# Altium schematic sheet S6XT10W POWER.SchDoc
size A4
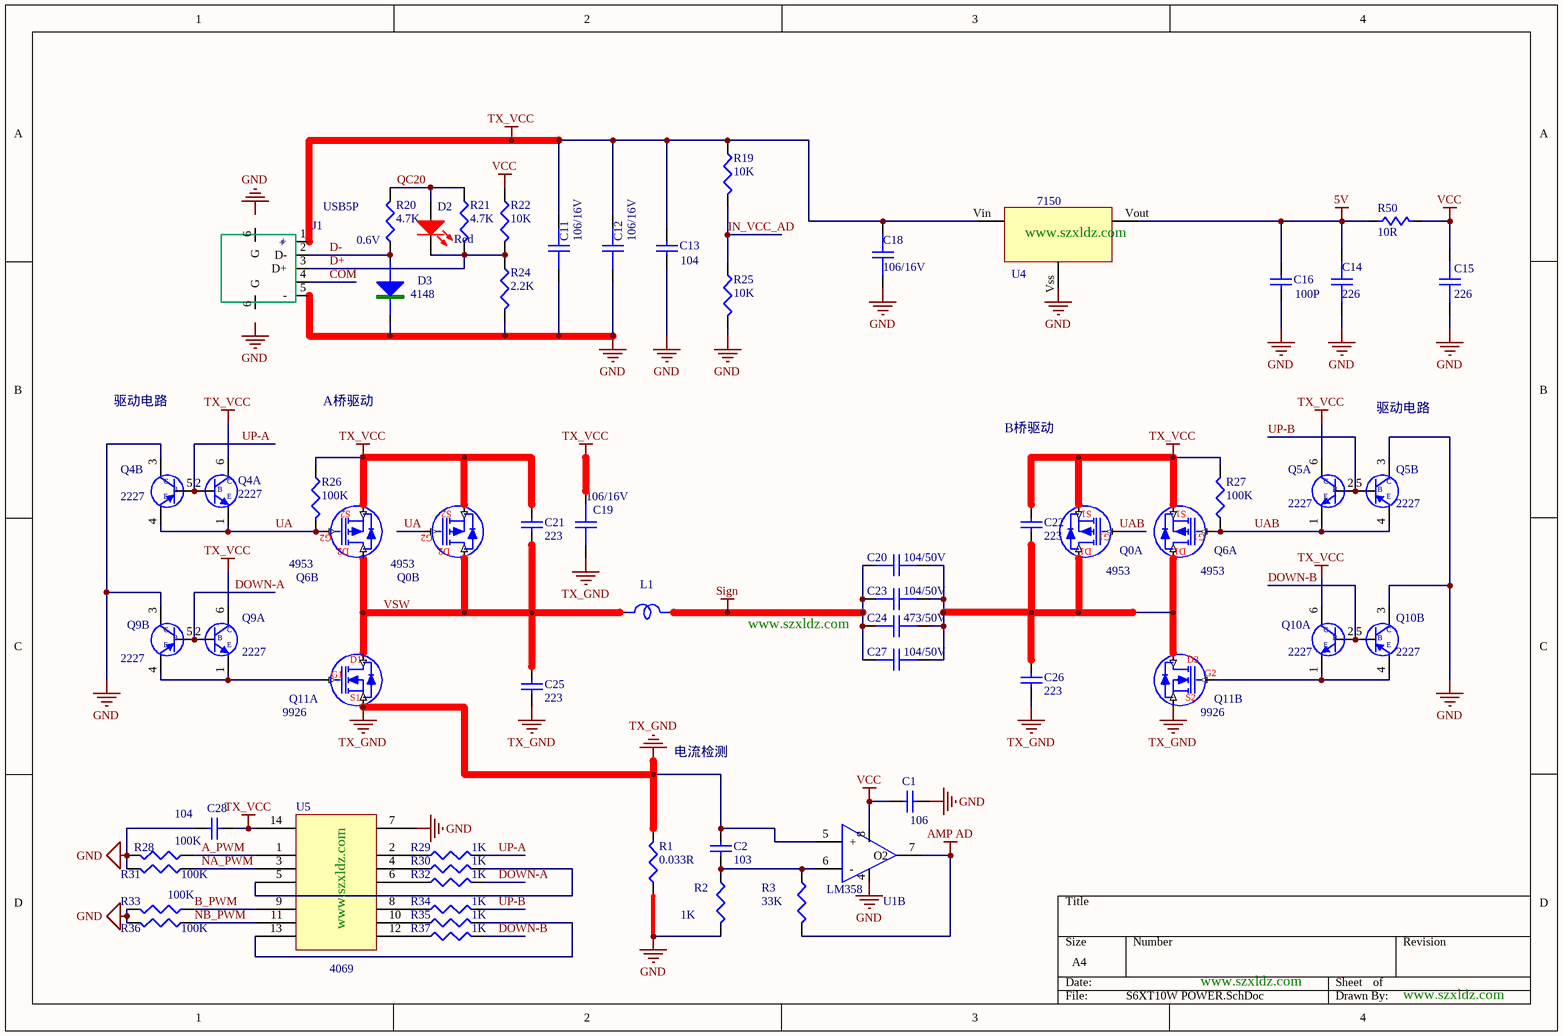
[diagram p0: S6XT10W POWER.SchDoc]

## Parts
C1  106  [C0603]
C2  103  [C0402]
C11  106/16V  [C0805]
C12  106/16V  [C0805]
C13  104  [C0402]
C14  226  [C0805]
C15  226  [C0805]
C16  100P  [C0402]
C18  106/16V  [C0805]
C19  106/16V  [C0805]
C20  104/50V  [C1206]
C21  223  [C0603]
C22  223  [C0603]
C23  104/50V  [C1206]
C24  473/50V  [C1206]
C25  223  [C1206]
C26  223  [C0603]
C27  104/50V  [C1206]
C28  104  [C0402]
D2  Red  [LED0603]
D3  4148  [SOD323]
J1  USB5P  [USB -MRO05]
L1  (no value)  [l5mm]
Q0  4953  [SOP8D]  (parts A,B of 2)
Q4  2227  [SOT363]  (parts A,B of 2)
Q5  2227  [SOT363]  (parts A,B of 2)
Q6  4953  [SOP8D]  (parts A,B of 2)
Q9  2227  [SOT363]  (parts A,B of 2)
Q10  2227  [SOT363]  (parts A,B of 2)
Q11  9926  [SOP8D]  (parts A,B of 2)
R1  0.033R  [R0805]
R2  1K  [R0402]
R3  33K  [R0402]
R19  10K  [R0402]
R20  4.7K  [R0402]
R21  4.7K  [R0402]
R22  10K  [R0402]
R24  2.2K  [R0402]
R25  10K  [R0402]
R26  100K  [R0402]
R27  100K  [R0402]
R28  100K  [R0402]
R29  1K  [R0402]
R30  1K  [R0402]
R31  100K  [R0402]
R32  1K  [R0402]
R33  100K  [R0402]
R34  1K  [R0402]
R35  1K  [R0402]
R36  100K  [R0402]
R37  1K  [R0402]
R50  10R  [R0402]
U1  LM358  [SOP8]  (part B of 2)
U4  7150  [SOT89a]
U5  4069  [SOP14]

## Nets
5V: C14.1 C16.1 R50.1 U4.Vout
AMP AD: R3.2 U1.7(O2)
GND: C1.1 C11.2 C12.2 C13.2 C14.2 C15.1 C16.2 C18.2 C28.1 D3.2 J1.5(-) Q4.3(C) Q5.3(C) Q9.3(C) Q10.3(C) R1.1 R2.2 R24.1 R25.1 R28.2 R31.2 R33.2 R36.2 U1.4 U4.Vss U5.7
Sign: C20.1 C23.1 C24.1 C27.1 L1.2
TX_GND: C2.1 C19.2 C25.1 C26.1 Q11.E1(S1) Q11.E2(S2) R1.2 U1.5(+)
TX_VCC: C11.1 C12.1 C13.1 C18.1 C19.1 C21.2 C22.2 C28.2 J1.1(+) Q0.E1(S1) Q0.E2(S2) Q4.6(C) Q5.6(C) Q6.E1(S1) Q6.E2(S2) Q9.6(C) Q10.6(C) R19.2 R26.1 R27.2 U4.Vin U5.14
VCC: C1.2 C15.2 R22.2 R50.2 U1.8
A_PWM: R28.1 U5.1
B_PWM: R33.1 U5.9
COM: J1.4
D+: D2.2(K) J1.3(D+) R21.1 R22.1 R24.2
D-: D3.1 J1.2(D-) R20.2
DOWN-A: Q9.2(B) Q9.5(B) R32.2
DOWN-B: Q10.2(B) Q10.5(B) R37.2
IN_VCC_AD: R19.1 R25.2
NA_PWM: R31.1 U5.3
NB_PWM: R36.1 U5.11
QC20: D2.1(A) R20.1 R21.2
UA: Q0.B2(G2) Q4.1(E) Q4.4(E) Q6.B2(G2) R26.2
UAB: Q0.B1(G1) Q5.1(E) Q5.4(E) Q6.B1(G1) R27.1
UP-A: Q4.2(B) Q4.5(B) R29.2
UP-B: Q5.2(B) Q5.5(B) R34.2
VSW: C21.1 C25.2 L1.1 Q0.C2(D2) Q6.C2(D2) Q11.C1(D1)
NetC2_2: C2.2 R2.1 R3.1 U1.6(-)
NetC20_2: C20.2 C22.1 C23.2 C24.2 C26.2 C27.2 Q0.C1(D1) Q6.C1(D1) Q11.C2(D2)
NetQ9_1: Q9.1(E) Q9.4(E) Q11.B1(G1)
NetQ10_1: Q10.1(E) Q10.4(E) Q11.B2(G2)
NetR29_1: R29.1 U5.2
NetR30_1: R30.1 U5.4
NetR30_2: R30.2 U5.5
NetR32_1: R32.1 U5.6
NetR34_1: R34.1 U5.8
NetR35_1: R35.1 U5.10
NetR35_2: R35.2 U5.13
NetR37_1: R37.1 U5.12

Not connected (* = marked no-connect by the designer): J1 6(G)

## Notes on the sheet
- 0.6V
- (near U4) www.szxldz.com
- 驱动电路
- A桥驱动
- B桥驱动
- www.szxldz.com
- 电流检测
- (near U5) www.szxldz.com
- Labels drawn without touching a wire or pin: GND

## Library data of the parts
C1 C2 C16 C21 C22 C25 C26 = Cap: Capacitor; Value: 104; Published: 8-Jun-2000; LatestRevisionDate: 17-Jul-2002; LatestRevisionNote: Re-released for DXP Platform.; Publisher: Altium Limited
C11 C12 C14 C15 C18-C20 C23 C24 C27 = CH
C13 C28 = Cap: Capacitor; Published: 8-Jun-2000; LatestRevisionDate: 17-Jul-2002; LatestRevisionNote: Re-released for DXP Platform.; Publisher: Altium Limited; Value: 104
D2 = LED02
D3 = D0: 1N4001
L1 = L: 1uH
Q0 Q6 = MOSFETP2
Q4 Q5 Q9 Q10 = N+PS
Q11 = MOSFETN2
R1 R3 R19-R22 R24-R28 R31 R33 R36 = R: 1K
R2 R29 R30 R32 R34 R35 R37 = R
R50 = Res01
U1 = 4558
U4 = VOLTREG
U5 = CD4069